# Altium schematic sheet solenoid_2.SchDoc: Solenoid 2
size A4; Organization: Badgerloop Electrical; Address1: 133 Engineering Research Building; Address2: 1500 Engineering Drive; Address3: Madison, Wi 53706
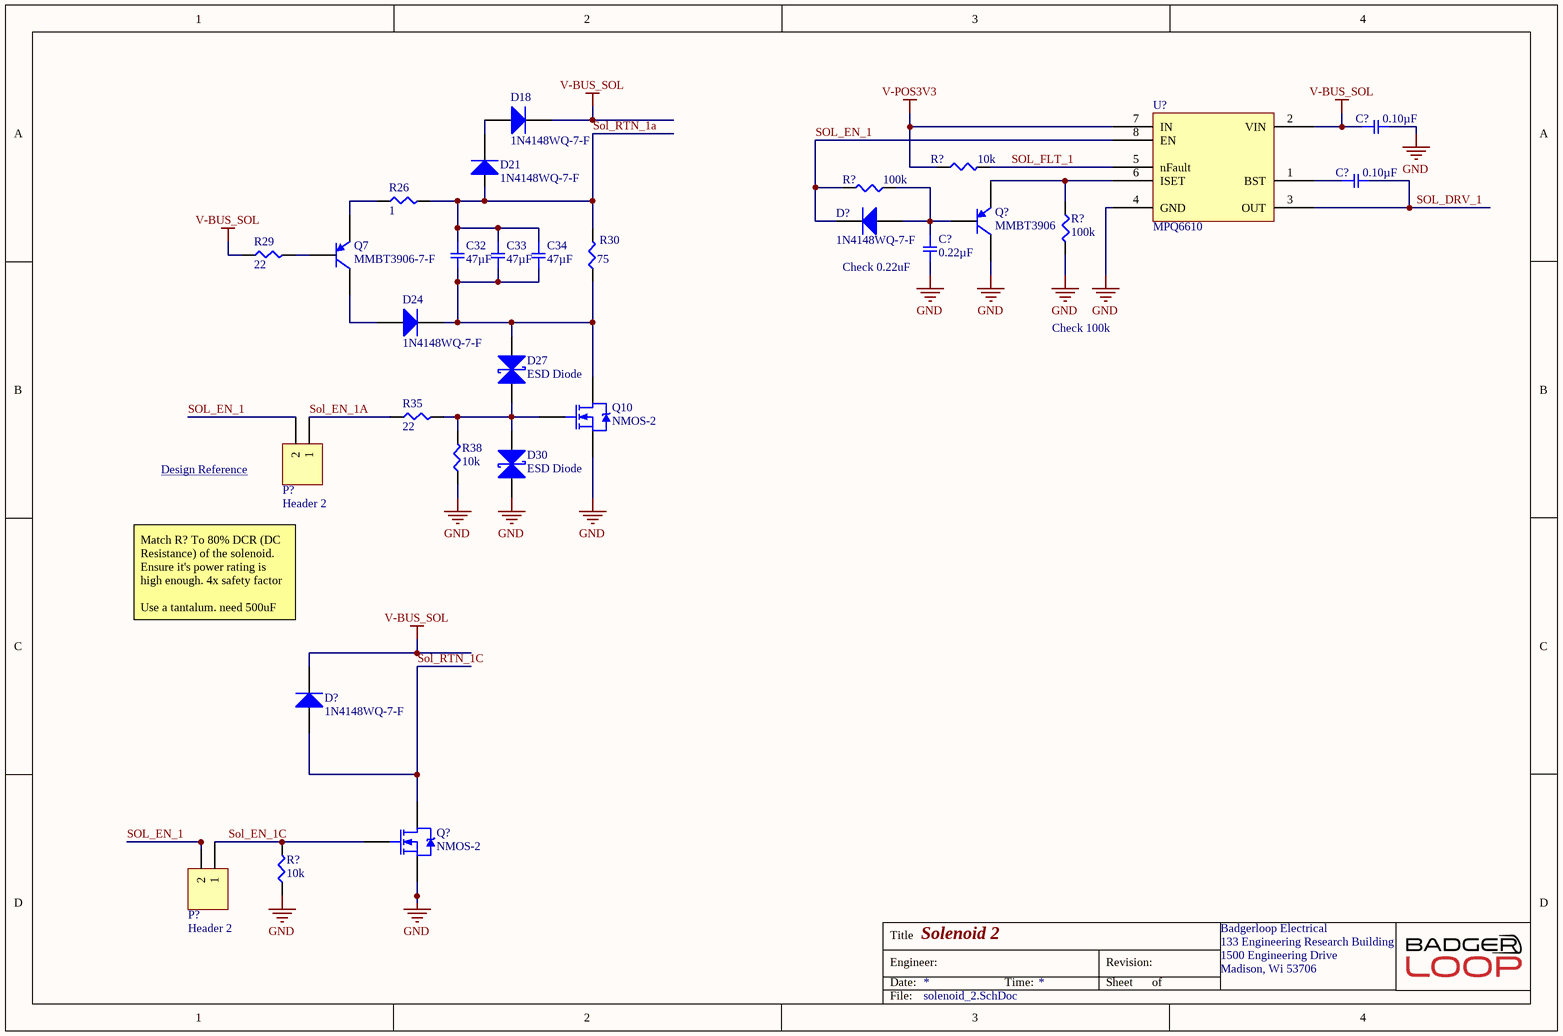
[diagram p0: solenoid_2.SchDoc]

## Parts
(Parts that share a designator on the sheet are numbered #1, #2 ... from top to bottom, then left to right.)
C32  47µF  [SMD-1206C]
C33  47µF  [SMD-1206C]
C34  47µF  [SMD-1206C]
C?#1  0.10µF  [SMD-0805C]
C?#2  0.10µF  [SMD-0805C]
C?#3  0.22µF  [SMD-0805C]
D18  1N4148WQ-7-F  [INDM3838X18N]
D21  1N4148WQ-7-F  [INDM3838X18N]
D24  1N4148WQ-7-F  [INDM3838X18N]
D27  ESD Diode  [SMD-0402-RES]
D30  ESD Diode  [SMD-0402-RES]
D?#1  1N4148WQ-7-F  [INDM3838X18N]
D?#2  1N4148WQ-7-F  [INDM3838X18N]
P?#1  Header 2  [Pin Header 1x2 TH Pitch 2.54mm]
P?#2  Header 2  [Pin Header 1x2 TH Pitch 2.54mm]
Q7  MMBT3906-7-F  [SOTFL103P240X110-3N]
Q10  NMOS-2
Q?#1  MMBT3906  [SOTFL103P240X110-3N]
Q?#2  NMOS-2
R26  1  [SMD-0805-RES]
R29  22  [SMD-1206-RES]
R30  75  [SMD-1206-RES]
R35  22  [SMD-1206-RES]
R38  10k  [SMD-0805-RES]
R?#1  10k  [SMD-0805-RES]
R?#2  100k  [SMD-0805-RES]
R?#3  100k  [SMD-0805-RES]
R?#4  10k  [SMD-0805-RES]
U?  MPQ6610  [SOP127P600X175-8N]

## Nets
GND: C?#1.2 C?#3.2 D30.1(A) Q10.3(S) Q?#1.3(C) Q?#2.3(S) R38.1 R?#3.2 R?#4.1 U?.4(GND)
V-BUS_SOL: C?#1.1 D18.2(K) D?#2.2(K) R29.1 U?.2(VIN)
V-POS3V3: R?#1.1 U?.7(IN)
SOL_DRV_1: C?#2.2 U?.3(OUT)
SOL_EN_1: D?#1.2(K) P?#1.2 P?#2.2 R?#2.2 U?.8(EN)
Sol_EN_1A: P?#1.1 R35.1
Sol_EN_1C: P?#2.1 Q?#2.1(G) R?#4.2
SOL_FLT_1: R?#1.2 U?.5(nFault)
Sol_RTN_1a: C32.1 C33.1 C34.1 D21.1(A) R26.2 R30.2
Sol_RTN_1C: D?#2.1(A) Q?#2.2(D)
NetC32_2: C32.2 C33.2 C34.2 D24.2(K) D27.2(K) Q10.2(D) R30.1
NetC?#2_1: C?#2.1 U?.1(BST)
NetC?#3_1: C?#3.1 D?#1.1(A) Q?#1.2(B) R?#2.1
NetD18_1: D18.1(A) D21.2(K)
NetD24_1: D24.1(A) Q7.3(C)
NetD27_1: D27.1(A) D30.2(K) Q10.1(G) R35.2 R38.2
NetQ7_1: Q7.1(E) R26.1
NetQ7_2: Q7.2(B) R29.2
NetQ?#1_1: Q?#1.1(E) R?#3.1 U?.6(ISET)

## Notes on the sheet
- (near C?#3) Check 0.22uF
- Check 100k
- (near P?#1) Design Reference <https://www.electronicdesign.com/analog/what-s-all-solenoid-driver-stuff-anyhow>
- Match R? To 80% DCR (DC Resistance) of the solenoid. Ensure it's power rating is high enough. 4x safety factor
  Use a tantalum. need 500uF
- Title
- Engineer:
- Date:
- Time:
- Revision:
- Sheet
- of
- File:

## Library data of the parts
C32-C34 = GRT31CR60J476ME13L: CAP CER 47UF 6.3V X5R 1206; Manufacturer: Murata Electronics North America; Factory Stock: 0; Unit Price (USD): 0.99; Minimum Quantity: 1; Tolerance: ±20%; Datasheets: http://search.murata.co.jp/Ceramy/image/img/A01X/G101/ENG/GRT31CR60J476ME13-01.pdf; Image: //media.digikey.com/Renders/Murata%20Renders/GR331BD72E473KW01L.jpg; Digi-Key Part Number: 490-12433-1-ND; Part Number: GRT31CR60J476ME13L; Quantity Available: 3920; @ qty: 0; Packaging: Cut Tape (CT); Series: GRT; Part Status: Active; Value: 47µF; Voltage: 6.3V; Temperature Coefficient: X5R; Operating Temperature: -55°C ~ 85°C; Features: -; Ratings: AEC-Q200; Applications: Automotive; Mounting Type: Surface Mount, MLCC; Package / Case: 1206 (3216 Metric); Size / Dimension: 0.126" L x 0.063" W (3.20mm x 1.60mm); Height - Seated (Max): -; Thickness (Max): 0.071" (1.80mm); Lead Spacing: -; Lead Style: -
C?#1 C?#2 = GRM21B7U1A104JA01L: CAP CER 0.1UF 10V U2J 0805; Manufacturer: Murata Electronics North America; Factory Stock: 0; Unit Price (USD): 0.4; Minimum Quantity: 1; Tolerance: ±5%; Datasheets: http://www.murata.com/~/media/webrenewal/support/library/catalog/products/capacitor/mlcc/c02e.pdf; Image: //media.digikey.com/Renders/Murata%20Renders/0805%20(2012%20Metric)%20.85mm.jpg; Digi-Key Part Number: 490-11592-1-ND; Part Number: GRM21B7U1A104JA01L; Quantity Available: 3390; @ qty: 0; Packaging: Cut Tape (CT); Series: GRM; Part Status: Active; Value: 0.10µF; Voltage: 10V; Temperature Coefficient: U2J; Operating Temperature: -55°C ~ 125°C; Features: -; Ratings: -; Applications: General Purpose; Mounting Type: Surface Mount, MLCC; Package / Case: 0805 (2012 Metric); Size / Dimension: 0.079" L x 0.049" W (2.00mm x 1.25mm); Height - Seated (Max): -; Thickness (Max): 0.053" (1.35mm); Lead Spacing: -; Lead Style: -
C?#3 = LLA215R71A224MA14L: CAP CER 0.22UF 10V X7R 0805; Manufacturer: Murata Electronics North America; Factory Stock: 0; Unit Price (USD): 0.36; Minimum Quantity: 1; Tolerance: ±20%; Datasheets: http://www.murata.com/~/media/webrenewal/support/library/catalog/products/capacitor/mlcc/c02e.pdf; Image: //media.digikey.com/Renders/Murata%20Renders/0805-LLA.jpg; Digi-Key Part Number: 490-4432-1-ND; Part Number: LLA215R71A224MA14L; Quantity Available: 9914; @ qty: 0; Packaging: Cut Tape (CT); Series: LLA; Part Status: Active; Value: 0.22µF; Voltage: 10V; Temperature Coefficient: X7R; Operating Temperature: -55°C ~ 125°C; Features: Low ESL (Multi-Terminal); Ratings: -; Applications: Bypass, Decoupling; Mounting Type: Surface Mount, MLCC; Package / Case: 0805 (2012 Metric); Size / Dimension: 0.079" L x 0.049" W (2.00mm x 1.25mm); Height - Seated (Max): -; Thickness (Max): 0.022" (0.55mm); Lead Spacing: -; Lead Style: -
D18 D21 D24 D?#1 D?#2 = 1N4148WQ-7-F: Diodes - General Purpose, Power, Switching SMT Fast Switching Diode; Manufacturer: Diodes Inc.; Digikey Link: https://www.digikey.com/product-detail/en/diodes-incorporated/1N4148WQ-7-F/1N4148WQ-7-FDITR-ND/8136126; Manufacturer P/N: 1N4148WQ-7-F; Digikey P/N: 1N4148WQ-7-FDITR-ND
D27 D30 = ESD Diode: ESD Supressor; Manufacturer P/N: Panasonic; Manufacturer: EZAEG; Digikey P/N: P13571CT-ND; Digikey Link: https://www.digikey.com/product-detail/en/panasonic-electronic-components/EZA-EG2A50AX/P13571CT-ND/1137239
P?#1 P?#2 = Header 2: Header, 2-Pin; LatestRevisionDate: 17-Jul-2002; LatestRevisionNote: Re-released for DXP Platform.; Publisher: Altium Limited
Q7 Q?#1 = MMBT3906-7-F: Manufacturer: Diodes Zetex; Collector Emitter Voltage (VCEO): 40V; Max Power Dissipation: 300mW; Polarity: PNP; Max Collector Current: 200mA; hFE Min: 100; Number of Elements: 1; Frequency: 250MHz; Emitter Base Voltage (VEBO): 6V; Collector Emitter Saturation Voltage: -400mV; Element Configuration: Single; Continuous Collector Current: -200mA; Voltage Rating (DC): -40V; Supplier 1: Digi-Key; Manufacturer Part Number: MMBT3906-7-F; Stock 1: 687580; Pricing 1: 1=0.12000, 10=0.11400, 100=0.06190, 500=0.03806, 1000=0.02596 (USD); RoHS: Yes; Mount: Surface Mount; Case/Package: SOT-23; Number of Pins: 3; Weight: 0.000282oz; Contact Plating: Tin,Matte; Min Operating Temperature: -55°C; Max Operating Temperature: 150°C; Packaging: Tape and Reel; Package Quantity: 3000; Transition Frequency: 250MHz; Collector Emitter Breakdown Voltage: 40V; Max Breakdown Voltage: 40V; Collector Base Voltage (VCBO): 40V; Power Dissipation: 300mW; Max Frequency: 250MHz; Gain Bandwidth Product: 250MHz; Current Rating: -200mA; Length: 3.05mm; Height: 1mm; Width: 1.4mm; Radiation Hardening: No; REACH SVHC: No SVHC; Lead Free: Lead Free; ComponentLink1URL: https://datasheet.ciiva.com/27052/1540746-27052408.pdf?src-supplier=Jameco; ComponentLink1Description: https://datasheet.ciiva.com/27052/1540746-27052408.pdf?src-supplier=Jameco; ComponentLink2URL: https://datasheet.ciiva.com/15139/getdatasheetpartid-255292-15139821.pdf?src-supplier=Verical; ComponentLink2Description: https://datasheet.ciiva.com/15139/getdatasheetpartid-255292-15139821.pdf?src-supplier=Verical; Supplier Part Number 1: MMBT3906-FDICT-ND
Q10 Q?#2 = NMOS-2_1: N-Channel Power MOSFET; ComponentLink1Description: Manufacturer Link; ComponentLink1URL: http://www.irf.com/; Parameter 1: *; Parameter 2: *; Parameter 3: *; Parameter 4: *
R26 = ERJ-6BQF1R0V: RES SMD 1 OHM 1% 1/3W 0805; Manufacturer: Panasonic Electronic Components; Factory Stock: 0; Unit Price (USD): 0.05834; @ qty: 1500; Power (Watts): 0.333W, 1/3W; Temperature Coefficient: ±200ppm/°C; Part Number: ERJ-6BQF1R0V; Datasheets: https://industrial.panasonic.com/cdbs/www-data/pdf/RDA0000/AOA0000C239.pdf; Image: //media.digikey.com/Renders/Panasonic%20Renders/ERJ-0805%20Pkg.jpg; Digi-Key Part Number: P17499CT-ND; Quantity Available: 808; Minimum Quantity: 1; Packaging: Cut Tape (CT); Series: ERJ; Part Status: Active; Value: 1; Tolerance: ±1%; Composition: Thick Film; Features: Automotive AEC-Q200, Current Sense; Operating Temperature: -55°C ~ 125°C; Package / Case: 0805 (2012 Metric); Supplier Device Package: 0805; Size / Dimension: 0.079" L x 0.049" W (2.00mm x 1.25mm); Height - Seated (Max): 0.028" (0.70mm); Number of Terminations: 2; Failure Rate: -
R29 R35 = ERJ-P08J220V: RES SMD 22 OHM 5% 2/3W 1206; Manufacturer: Panasonic Electronic Components; Factory Stock: 0; Unit Price (USD): 0.02178; @ qty: 1500; Minimum Quantity: 1; Power (Watts): 0.667W, 2/3W; Temperature Coefficient: ±200ppm/°C; Part Number: ERJ-P08J220V; Datasheets: https://industrial.panasonic.com/cdbs/www-data/pdf/RDA0000/AOA0000C243.pdf; Image: //media.digikey.com/Renders/Panasonic%20Renders/ERJ-1206%20Pkg.jpg; Digi-Key Part Number: P22ALCT-ND; Quantity Available: 25633; Packaging: Cut Tape (CT); Series: ERJ; Part Status: Active; Value: 22; Tolerance: ±5%; Composition: Thick Film; Features: Automotive AEC-Q200, Pulse Withstanding; Operating Temperature: -55°C ~ 155°C; Package / Case: 1206 (3216 Metric); Supplier Device Package: 1206; Size / Dimension: 0.126" L x 0.063" W (3.20mm x 1.60mm); Height - Seated (Max): 0.028" (0.70mm); Number of Terminations: 2; Failure Rate: -
R30 = ERJ-P08J750V: RES SMD 75 OHM 5% 2/3W 1206; Manufacturer: Panasonic Electronic Components; Factory Stock: 0; Unit Price (USD): 0.02178; @ qty: 1500; Minimum Quantity: 1; Power (Watts): 0.667W, 2/3W; Temperature Coefficient: ±200ppm/°C; Part Number: ERJ-P08J750V; Datasheets: https://industrial.panasonic.com/cdbs/www-data/pdf/RDA0000/AOA0000C243.pdf; Image: //media.digikey.com/Renders/Panasonic%20Renders/ERJ-1206%20Pkg.jpg; Digi-Key Part Number: P75ALCT-ND; Quantity Available: 82593; Packaging: Cut Tape (CT); Series: ERJ; Part Status: Active; Value: 75; Tolerance: ±5%; Composition: Thick Film; Features: Automotive AEC-Q200, Pulse Withstanding; Operating Temperature: -55°C ~ 155°C; Package / Case: 1206 (3216 Metric); Supplier Device Package: 1206; Size / Dimension: 0.126" L x 0.063" W (3.20mm x 1.60mm); Height - Seated (Max): 0.028" (0.70mm); Number of Terminations: 2; Failure Rate: -
R38 R?#1 R?#4 = ERJ-P06J103V: RES SMD 10K OHM 5% 1/2W 0805; Manufacturer: Panasonic Electronic Components; Factory Stock: 0; Unit Price (USD): 0.01839; @ qty: 1500; Minimum Quantity: 1; Power (Watts): 0.5W, 1/2W; Temperature Coefficient: ±200ppm/°C; Part Number: ERJ-P06J103V; Datasheets: https://industrial.panasonic.com/cdbs/www-data/pdf/RDA0000/AOA0000C243.pdf; Image: //media.digikey.com/Renders/Panasonic%20Renders/ERJ-0805%20Pkg.jpg; Digi-Key Part Number: P10KADCT-ND; Quantity Available: 413576; Packaging: Cut Tape (CT); Series: ERJ; Part Status: Active; Value: 10k; Tolerance: ±5%; Composition: Thick Film; Features: Automotive AEC-Q200, Pulse Withstanding; Operating Temperature: -55°C ~ 155°C; Package / Case: 0805 (2012 Metric); Supplier Device Package: 0805; Size / Dimension: 0.079" L x 0.049" W (2.00mm x 1.25mm); Height - Seated (Max): 0.028" (0.70mm); Number of Terminations: 2; Failure Rate: -
R?#2 R?#3 = ERJ-P06J104V: RES SMD 100K OHM 5% 1/2W 0805; Manufacturer: Panasonic Electronic Components; Factory Stock: 0; Unit Price (USD): 0.01839; @ qty: 1500; Minimum Quantity: 1; Power (Watts): 0.5W, 1/2W; Temperature Coefficient: ±200ppm/°C; Part Number: ERJ-P06J104V; Datasheets: https://industrial.panasonic.com/cdbs/www-data/pdf/RDA0000/AOA0000C243.pdf; Image: //media.digikey.com/Renders/Panasonic%20Renders/ERJ-0805%20Pkg.jpg; Digi-Key Part Number: P100KADCT-ND; Quantity Available: 82264; Packaging: Cut Tape (CT); Series: ERJ; Part Status: Active; Value: 100k; Tolerance: ±5%; Composition: Thick Film; Features: Automotive AEC-Q200, Pulse Withstanding; Operating Temperature: -55°C ~ 155°C; Package / Case: 0805 (2012 Metric); Supplier Device Package: 0805; Size / Dimension: 0.079" L x 0.049" W (2.00mm x 1.25mm); Height - Seated (Max): 0.028" (0.70mm); Number of Terminations: 2; Failure Rate: -